# EAGLE design equaliser_TDA7418 (EAGLE 7.6.0)
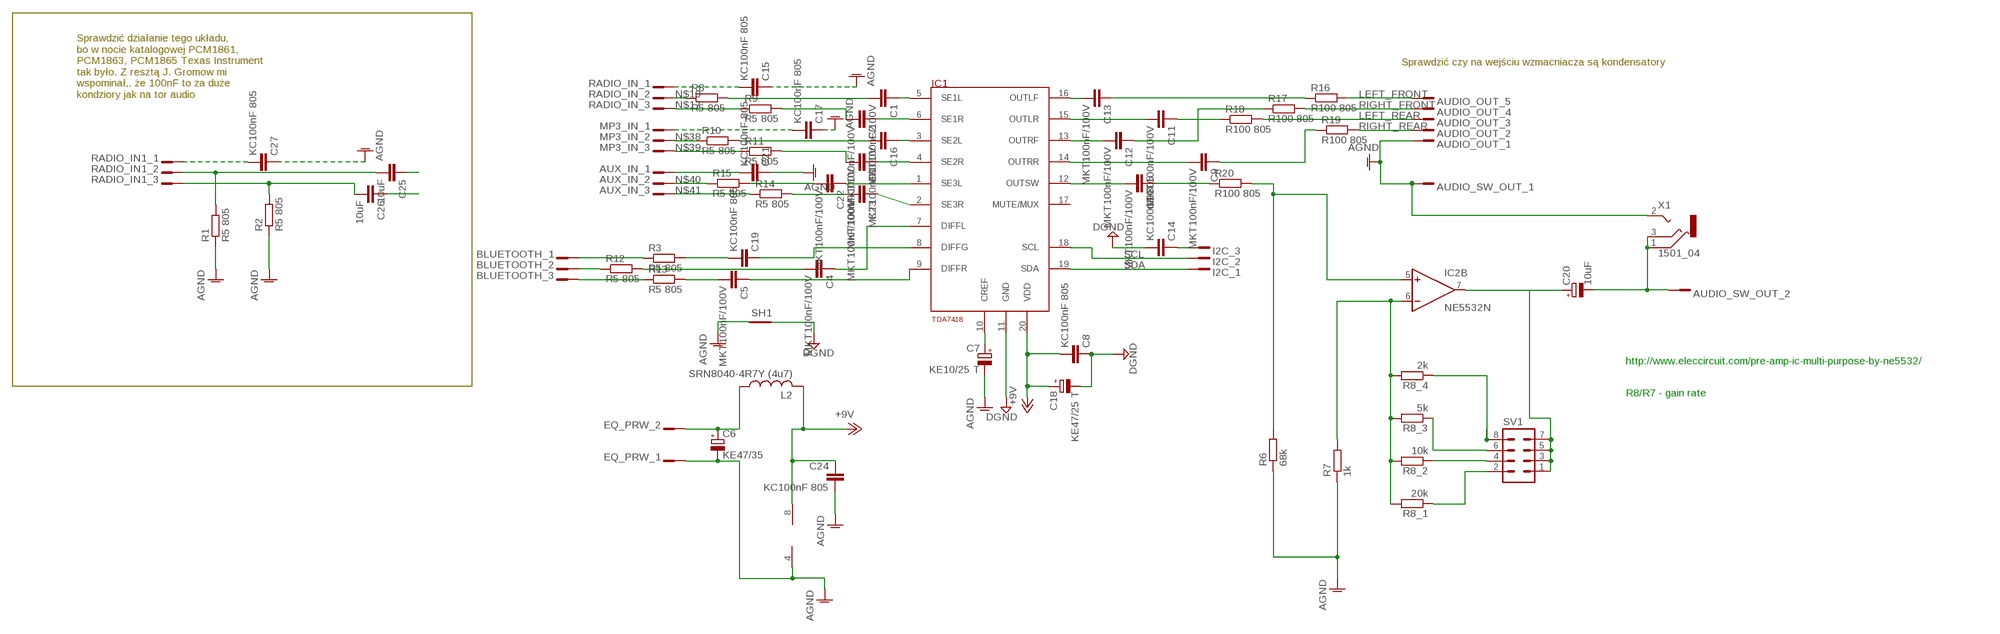
[diagram p0: schematic, sheet 1]

## Parts
AUDIO_OUT  JST_5_PIN_B5B-PH-KS  [B5B-PH-KS]
AUDIO_SW_OUT  JST_2_PIN_B2B-PH-KS  [B2B-PH-KS]
AUX_IN  JST_3_PIN_B3B-PH-KS  [B3B-PH-KS]
BLUETOOTH  JST_3_PIN_B3B-PH-KS  [B3B-PH-KS]
C1  MKT100nF/100V  C-EU050-035X075  [C050-035X075]
C2  MKT100nF/100V  C-EU050-035X075  [C050-035X075]
C3  MKT100nF/100V  C-EU050-035X075  [C050-035X075]
C4  MKT100nF/100V  C-EU050-035X075  [C050-035X075]
C5  MKT100nF/100V  C-EU050-035X075  [C050-035X075]
C6  KE47/35  CPOL-EUTT2D6  [TT2D6]
C7  KE10/25 T  CPOL-EUE1.8-4  [E1,8-4]
C8  KC100nF 805  C-EUC0805  [C0805]
C9  MKT100nF/100V  C-EU050-035X075  [C050-035X075]
C10  MKT100nF/100V  C-EU050-035X075  [C050-035X075]
C11  MKT100nF/100V  C-EU050-035X075  [C050-035X075]
C12  MKT100nF/100V  C-EU050-035X075  [C050-035X075]
C13  MKT100nF/100V  C-EU050-035X075  [C050-035X075]
C14  KC100nF 805  C-EUC0805  [C0805]
C15  KC100nF 805  C-EUC0805  [C0805]
C16  MKT100nF/100V  C-EU050-035X075  [C050-035X075]
C17  KC100nF 805  C-EUC0805  [C0805]
C18  KE47/25 T  CPOL-EUB45181B  [B45181B]
C19  KC100nF 805  C-EUC0805  [C0805]
C20  10uF  CPOL-EUTT2D6  [TT2D6]
C21  KC100nF 805  C-EUC0805  [C0805]
C22  MKT100nF/100V  C-EU050-035X075  [C050-035X075]
C23  MKT100nF/100V  C-EU050-035X075  [C050-035X075]
C24  KC100nF 805  C-EUC0805  [C0805]
C25  10uF  C-EU050-035X075  [C050-035X075]
C26  10uF  C-EU050-035X075  [C050-035X075]
C27  KC100nF 805  C-EUC0805  [C0805]
EQ_PRW  JST_2_PIN_B2B-XH-A  [B2B-XH-A]
I2C  JST_3_PIN_B3B-PH-KS  [B3B-PH-KS]
IC1  TDA7418  [SO20]
IC2  NE5532N  [DIL08]
L2  SRN8040-4R7Y (4u7)  L-US0204/5  [0204/5]
MP3_IN  JST_3_PIN_B3B-PH-KS  [B3B-PH-KS]
R1  R5 805  R-EU_R0805  [R0805]
R2  R5 805  R-EU_R0805  [R0805]
R3  R5 805  R-EU_R0805  [R0805]
R6  68k  R-EU_R0805  [R0805]
R7  1k  R-EU_R0805  [R0805]
R8  R5 805  R-EU_R0805  [R0805]
R8_1  20k  R-EU_R0805  [R0805]
R8_2  10k  R-EU_R0805  [R0805]
R8_3  5k  R-EU_R0805  [R0805]
R8_4  2k  R-EU_R0805  [R0805]
R9  R5 805  R-EU_R0805  [R0805]
R10  R5 805  R-EU_R0805  [R0805]
R11  R5 805  R-EU_R0805  [R0805]
R12  R5 805  R-EU_R0805  [R0805]
R13  R5 805  R-EU_R0805  [R0805]
R14  R5 805  R-EU_R0805  [R0805]
R15  R5 805  R-EU_R0805  [R0805]
R16  R100 805  R-EU_R0805  [R0805]
R17  R100 805  R-EU_R0805  [R0805]
R18  R100 805  R-EU_R0805  [R0805]
R19  R100 805  R-EU_R0805  [R0805]
R20  R100 805  R-EU_R0805  [R0805]
RADIO_IN  JST_3_PIN_B3B-PH-KS  [B3B-PH-KS]
RADIO_IN1  JST_3_PIN_B3B-PH-KS  [B3B-PH-KS]
SH1  SHORT-HT5  [SHORT_TOP-50]
SV1  MA04-2  [MA04-2]
X1  1501_04  [1501_05]

## Nets
+9V0: C8.2 C18.+ C24.1 IC1.20(VDD) IC2.8(P:V+) L2.2 ; supply symbol labelled +9V
AGND: AUDIO_OUT.P$1 AUDIO_SW_OUT.P$1 C6.- C7.- C15.1 C17.1 C21.1 C24.2 C27.1 EQ_PRW.P$1 IC2.4(P:V-) R1.1 R2.1 R6.1 R7.1 SH1.1 X1.2
DGND: C8.1 C14.2 C18.- IC1.11(GND) SH1.2
L1: C1.2 R8.2
L2: C16.2 R10.2
L3: C4.2 R12.2
L4: C25.2 R1.2 RADIO_IN1.P$2
LEFT_FRONT: AUDIO_OUT.P$5 R16.2
LEFT_REAR: AUDIO_OUT.P$3 R18.2
N$1: C6.+ EQ_PRW.P$2 L2.1
N$2: R8_1.1 SV1.2
N$3: C7.+ IC1.10(CREF)
N$4: C1.1 IC1.5(SE1L)
N$5: C2.1 IC1.6(SE1R)
N$6: C16.1 IC1.3(SE2L)
N$7: C3.1 IC1.4(SE2R)
N$8: C23.1 IC1.2(SE3R)
N$9: C22.1 IC1.1(SE3L)
N$10: R8.1 RADIO_IN.P$2
N$11: AUDIO_SW_OUT.P$2 C20.- X1.1 X1.3
N$12: C13.2 IC1.16(OUTLF)
N$13: C11.2 IC1.15(OUTLR)
N$14: C11.1 R18.1
N$15: C9.1 R19.1
N$16: C12.2 IC1.13(OUTRF)
N$17: R9.1 RADIO_IN.P$3
N$18: C9.2 IC1.14(OUTRR)
N$19: C10.2 IC1.12(OUTSW)
N$20: R8_2.1 SV1.4
N$21: C20.+ IC2.7(B:OUT) SV1.1 SV1.3 SV1.5 SV1.7
N$22: R8_3.1 SV1.6
N$23: C14.1 I2C.P$3
N$24: C15.2 RADIO_IN.P$1
N$25: C13.1 R16.1
N$26: C17.2 MP3_IN.P$1
N$27: BLUETOOTH.P$1 R3.1
N$28: C25.1
N$29: R8_4.1 SV1.8
N$30: C4.1 IC1.7(DIFFL)
N$31: C5.1 IC1.9(DIFFR)
N$32: C22.2 R15.2
N$33: AUX_IN.P$3 R14.1
N$34: IC2.6(B:-IN) R7.2 R8_1.2 R8_2.2 R8_3.2 R8_4.2
N$35: IC2.5(B:+IN) R6.2 R20.2
N$36: C12.1 R17.1
N$37: C10.1 R20.1
N$38: MP3_IN.P$2 R10.1
N$39: MP3_IN.P$3 R11.1
N$40: BLUETOOTH.P$2 R12.1
N$41: BLUETOOTH.P$3 R13.1
N$42: AUX_IN.P$2 R15.1
N$43: C23.2 R14.2
N$44: C2.2 R9.2
N$45: C3.2 R11.2
N$46: C5.2 R13.2
N$47: C26.1
N$48: AUX_IN.P$1 C21.2
N$49: C27.2 RADIO_IN1.P$1
N$50: C19.1 IC1.8(DIFFG)
N$51: C26.2 R2.2 RADIO_IN1.P$3
N$52: C19.2 R3.2
RIGHT_FRONT: AUDIO_OUT.P$4 R17.2
RIGHT_REAR: AUDIO_OUT.P$2 R19.2
SCL: I2C.P$2 IC1.18(SCL)
SDA: I2C.P$1 IC1.19(SDA)
Unconnected: IC1.17(MUTE/MUX) IC2.1(A:OUT) IC2.2(A:-IN) IC2.3(A:+IN)

## Notes on the sheet
- Sprawdzić czy na wejściu wzmacniacza są kondensatory
- Sprawdzić działanie tego układu,
  bo w nocie katalogowej PCM1861,
  PCM1863, PCM1865 Texas Instrument
  tak było. Z resztą J. Gromow mi
  wspominał,. że 100nF to za duże
  kondziory jak na tor audio
- http://www.eleccircuit.com/pre-amp-ic-multi-purpose-by-ne5532/
- R8/R7 - gain rate

## Library data of the parts
AUDIO_OUT = conn-JST:JST_5_PIN_
AUDIO_SW_OUT EQ_PRW = conn-JST:JST_2_PIN_
AUX_IN BLUETOOTH I2C MP3_IN RADIO_IN RADIO_IN1 = conn-JST:JST_3_PIN_
C1-C5 C8-C17 C19 C21-C27 = rcl:C-EU: CAPACITOR, European symbol
C6 C18 C20 = rcl:CPOL-EU: POLARIZED CAPACITOR, European symbol
C7 = resistor:CPOL-EU: POLARIZED CAPACITOR, European symbol
IC1 = TDA7318_DIP:TDA7418; PACKAGE: SO20
IC2 = linear:NE5532: AUDIO AMPLIFIER
L2 = rcl:L-US: INDUCTOR, American symbol
R1-R3 R6-R8 R8_1-R8_4 R9-R20 = resistor:R-EU_: RESISTOR, European symbol
SH1 = shorts-old:SHORT-H: Short between two nets; BOM: no
SV1 = con-lstb:MA04-2: PIN HEADER; OC_FARNELL: unknown; OC_NEWARK: unknown
X1 = con-lumberg:1501_0*: Jack connectors according to JISC 6560, 2.5 mm Klinkensteckverbinder nach JISC 6560, 2,5 mm Source: http://www.lumberg.com/Produkte/PDFs/1501_05.pdfedit 1501_03 http://www.lumberg.com/Produkte/PDFs/1501_06.pdf; OC_FARNELL: 1216977; OC_NEWARK: unknown

## Board
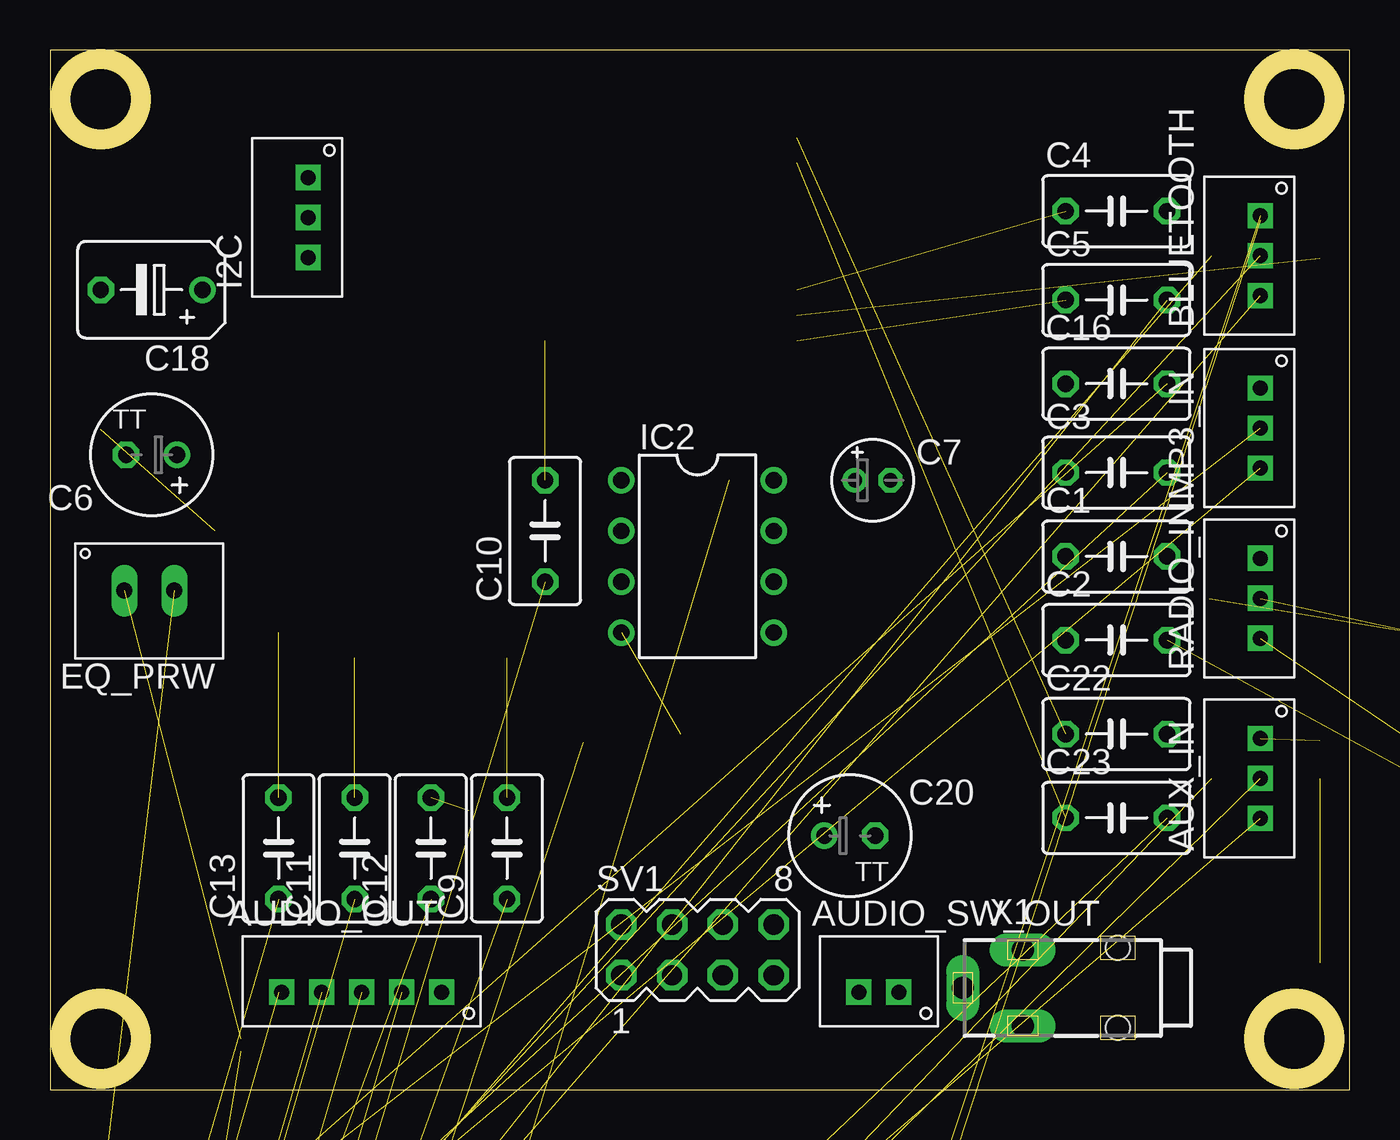
[diagram p1: board, top side]
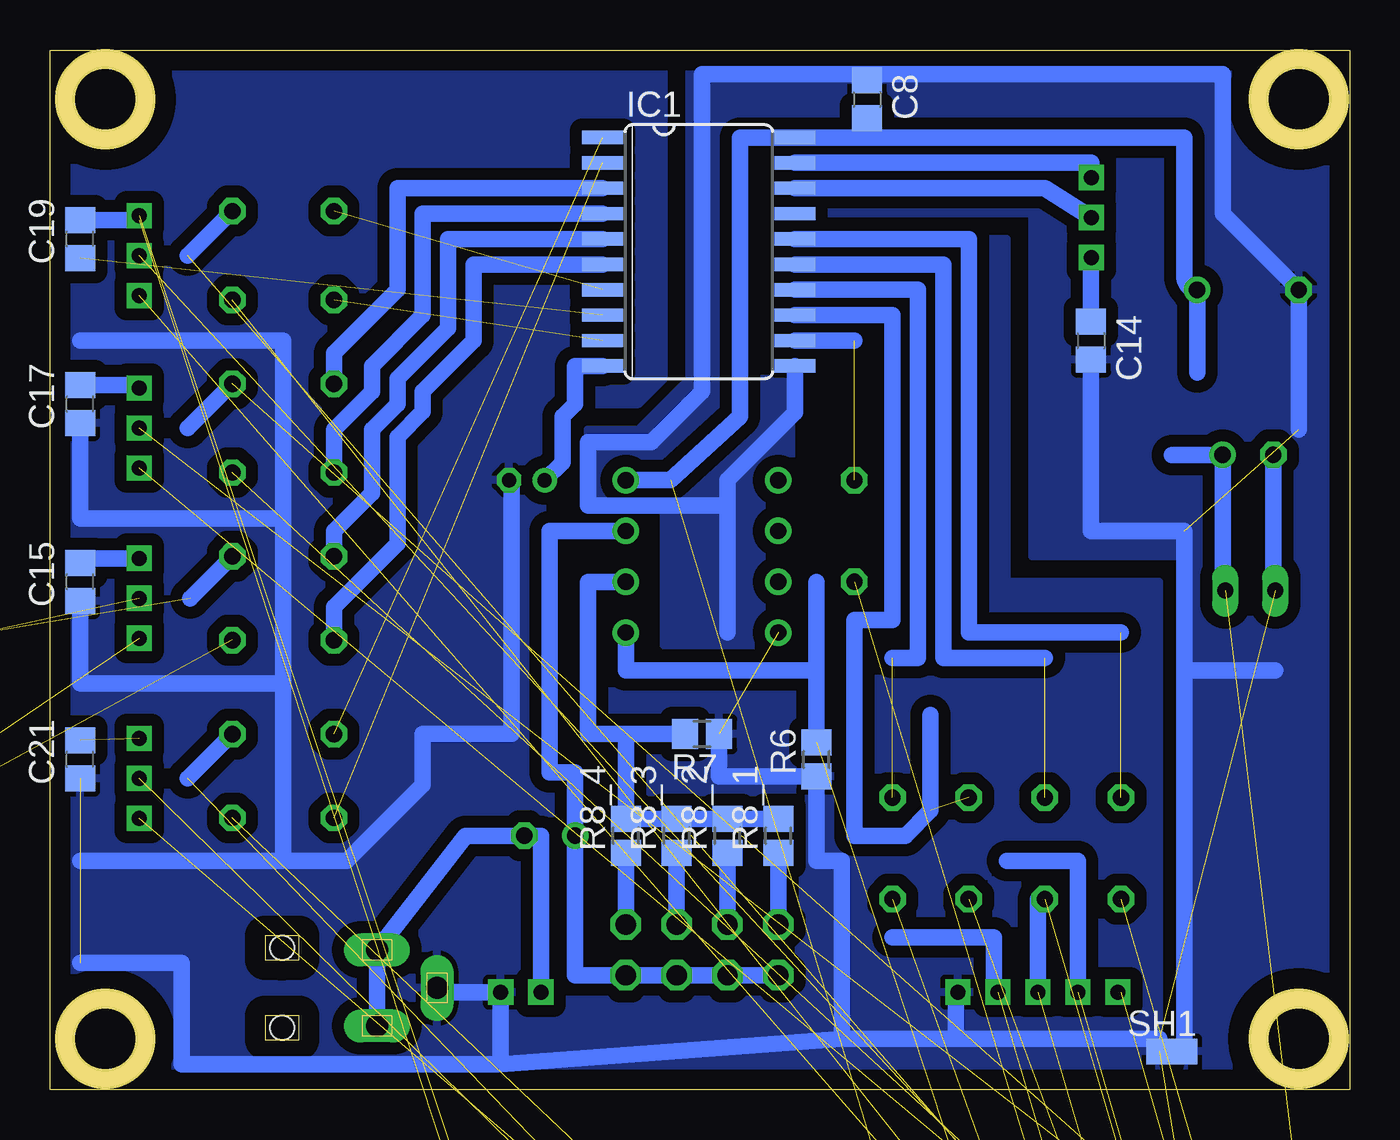
[diagram p2: board, bottom side, seen from below]

Size 65 x 52 mm. Coordinates in mm from the lower left corner, seen from the top.
Outline: 0,0 65,0 65,52 0,52 0,0
Outline: circle at 2.54,49.53 radius 2
Outline: circle at 62.23,49.53 radius 2
Outline: circle at 62.23,2.54 radius 2
Outline: circle at 2.54,2.54 radius 2
Copper layers (1*16): Top 0.035mm / dielectric 1.5mm / Bottom 0.035mm
Design rules "default": minimum track width 10mil, minimum drill 24mil, track to track 8mil, track to pad 8mil, pad to pad 8mil, via to via 8mil, smd to smd 8mil, copper to edge 40mil, drill to drill 8mil, minimum pad ring 10mil, minimum via ring 8mil, stop-mask expansion 4mil, vias tented up to drill 0mil, thermal gap 10mil

### Footprints (pad centres in the part's own frame; a part is rotated, then mirrored left to right if it is on the bottom)
B5B-PH-KS = drill 0.75 pad 1.2 square: P$1 -2,1.7; P$2 -4,1.7; P$3 -6,1.7; P$4 -8,1.7; P$5 -10,1.7
B2B-PH-KS = drill 0.75 pad 1.2 square: P$1 -2,1.7; P$2 -4,1.7
B3B-PH-KS = drill 0.75 pad 1.2 square: P$1 -2,1.7; P$2 -4,1.7; P$3 -6,1.7
C050-035X075 = drill 0.813 octagon: 1 -2.54,0; 2 2.54,0
TT2D6 = drill 0.813: + -1.27,0 | drill 0.813 octagon: - 1.27,0
E1,8-4 = drill 0.711 pad 1.168: + -0.889,0 | drill 0.711 pad 1.168 octagon: - 0.889,0
C0805 = smd 1.3 x 1.5: 1 -0.95,0; 2 0.95,0
B45181B = drill 0.813: + -2.54,0 | drill 0.813 octagon: - 2.54,0
B2B-XH-A = drill 0.8 long: P$1 -2.45,2.35; P$2 -4.95,2.35
SO20 = smd 0.66 x 2.032: 1 -4.445,-3.073; 2 -3.175,-3.073; 3 -1.905,-3.073; 4 -0.635,-3.073; 5 0.635,-3.073; 6 1.905,-3.073; 7 3.175,-3.073; 8 4.445,-3.073; 9 5.715,-3.073; 10 6.985,-3.073; 11 6.985,6.553; 12 5.715,6.553; 13 4.445,6.553; 14 3.175,6.553; 15 1.905,6.553; 16 0.635,6.553; 17 -0.635,6.553; 18 -1.905,6.553; 19 -3.175,6.553; 20 -4.445,6.553
DIL08 = drill 0.813 pad 1.27: 1 -3.81,-3.81; 2 -1.27,-3.81; 3 1.27,-3.81; 4 3.81,-3.81; 5 3.81,3.81; 6 1.27,3.81; 7 -1.27,3.81; 8 -3.81,3.81
0204/5 = drill 0.813 octagon: 1 -2.54,0; 2 2.54,0
R0805 = smd 1.3 x 1.5: 1 -0.85,0; 2 0.85,0
SHORT_TOP-50 = smd 1.27 x 1.27: 1 0.635,0; 2 -0.635,0
MA04-2 = drill 1.016 octagon: 1 -3.81,-1.27; 2 -3.81,1.27; 3 -1.27,-1.27; 4 -1.27,1.27; 5 1.27,-1.27; 6 1.27,1.27; 7 3.81,-1.27; 8 3.81,1.27
1501_05 = drill 1.1 pad 1.4 long: 1 -1.9,-8.5; 2 0,-11.5; 3 1.9,-8.5 | hole 1.2: -2,-3.75; 2,-3.75

### Placement (x,y rotation side)
AUDIO_OUT  21.59,3.17 0 top
AUDIO_SW_OUT  44.45,3.17 0 top
AUX_IN  62.23,19.56 90 top
BLUETOOTH  62.23,45.72 90 top
C1  53.34,26.67 0 top
C2  53.34,22.48 0 top
C3  53.34,30.86 0 top
C4  53.34,43.94 0 top
C5  53.34,39.5 0 top
C6  5.08,31.75 180 top
C7  41.15,30.48 0 top
C8  24.13,49.53 270 bottom
C9  22.86,12.06 90 top
C10  24.77,27.94 90 top
C11  15.24,12.06 90 top
C12  19.05,12.06 90 top
C13  11.43,12.06 90 top
C14  12.93,37.47 270 bottom
C15  63.5,25.4 90 bottom
C16  53.34,35.31 0 top
C17  63.5,34.29 90 bottom
C18  5.08,40.01 180 top
C19  63.5,42.55 90 bottom
C20  40.01,12.7 0 top
C21  63.5,16.51 90 bottom
C22  53.34,17.78 0 top
C23  53.34,13.59 0 top
C24  -7.62,-96.52 0 top  (outside the outline)
C25  -5.08,-106.68 0 top  (outside the outline)
C26  -5.08,-120.65 0 top  (outside the outline)
C27  13.97,-144.78 0 top  (outside the outline)
EQ_PRW  1.27,27.3 180 top
I2C  14.61,47.62 90 top
IC1  34.29,43.18 270 bottom
IC2  32.38,26.67 270 top
L2  -5.08,-90.17 0 top  (outside the outline)
MP3_IN  62.23,37.08 90 top
R1  1.27,-156.21 0 top  (outside the outline)
R2  8.89,-156.21 0 top  (outside the outline)
R3  -7.62,-162.56 0 top  (outside the outline)
R6  26.67,16.51 90 bottom
R7  32.38,17.78 180 bottom
R8  74.93,21.59 0 top  (outside the outline)
R8_1  28.57,12.7 90 bottom
R8_2  31.11,12.7 90 bottom
R8_3  33.66,12.7 90 bottom
R8_4  36.2,12.7 90 bottom
R9  72.39,13.97 180 top  (outside the outline)
R10  -7.62,-20.32 0 top  (outside the outline)
R11  -7.62,-26.67 0 top  (outside the outline)
R12  -7.62,-33.02 0 top  (outside the outline)
R13  -7.62,-39.37 0 top  (outside the outline)
R14  -7.62,-45.72 0 top  (outside the outline)
R15  -7.62,-52.07 0 top  (outside the outline)
R16  -7.62,-58.42 0 top  (outside the outline)
R17  -7.62,-64.77 0 top  (outside the outline)
R18  -7.62,-71.12 0 top  (outside the outline)
R19  -7.62,-77.47 0 top  (outside the outline)
R20  -7.62,-83.82 0 top  (outside the outline)
RADIO_IN  62.23,28.57 90 top
RADIO_IN1  -1.27,-148.59 0 top  (outside the outline)
SH1  8.89,1.91 180 bottom
SV1  32.38,6.99 0 top
X1  57.15,5.08 270 top

### Tracks (layer width: path | path; a pad name or v marks a point on that pad's centre or on a via)
+9V0  (2 unrouted)
  Bottom 0.813: IC2.8 33.97,30.48 30.48,33.66 30.48,47.62 IC1.20 24.13,47.62 | 24.13,47.62 8.26,47.62 8.26,40.64 arc-90 C18.+ 7.62,35.88 | C8.2 24.13,47.62
AGND  (8 unrouted)
  Bottom 0.813: AUDIO_OUT.P$1 19.68,4.88 19.68,2.54 | 19.68,2.54 25.4,2.54 | 25.4,2.54 25.4,11.43 26.67,11.43 R6.1 31.54,15.66 R7.1 | 42.45,1.27 58.42,1.27 58.42,6.35 63.5,6.35 | 42.45,1.27 25.4,2.54 | SH1.1 9.53,2.54 19.68,2.54 | 63.5,37.47 53.34,37.47 53.34,28.57 | 53.34,28.57 53.34,20.32 | 53.34,20.32 53.34,11.43 | C17.1 63.5,28.57 53.34,28.57 | C15.1 63.5,20.32 53.34,20.32 | C7.- arc90 41.91,30.35 41.91,17.78 46.35,17.78 46.35,15.24 50.16,11.43 53.34,11.43 | 42.45,1.27 AUDIO_SW_OUT.P$1 45.65,4.88 X1.2 | 63.5,11.43 53.34,11.43 | EQ_PRW.P$1 3.81,25.05 C6.-
  pour Bottom (isolate 0.61): 65.41,-1.27 9.53,-1.27 9.53,25.4 17.14,25.4 17.14,42.55 26.67,42.55 26.67,20.95 33.66,20.95 33.66,27.94 39.37,27.94 39.37,34.29 35.56,34.29 34.29,35.56 34.29,52.7 65.41,52.7
DGND  (1 unrouted)
  Bottom 0.813: 31.11,22.86 31.11,29.21 | 31.11,29.21 31.11,30.48 27.74,33.86 IC1.11 | 31.11,29.21 38.1,29.21 38.1,32.38 34.92,32.38 32.38,34.92 32.38,50.8 24.13,50.8 | 8.26,20.95 8.26,27.94 12.93,27.94 C14.2 | 8.26,20.95 3.72,20.95 | SH1.2 8.26,20.95 | 24.13,50.8 6.35,50.8 6.35,43.81 C18.- 2.54,33.02 | 24.13,50.8 C8.1
  pour Bottom (isolate 0.61): 8.26,-1.27 8.26,26.67 15.88,26.67 15.88,43.81 29.84,43.81 29.84,35.56 27.94,35.56 27.94,22.23 34.29,22.23 34.29,29.21 38.1,29.21 38.1,33.02 35.56,33.02 33.02,35.56 33.02,52.7 -0.64,52.7 -0.64,-1.27
L1  (1 unrouted)
  Bottom 0.813: 57.98,24.57 C1.2
L2  (1 unrouted)
  Bottom 0.813: 58.1,33.08 C16.2
L3  (1 unrouted)
  Bottom 0.813: 58.1,41.72 C4.2
L4  (2 unrouted)
LEFT_FRONT  (1 unrouted)
  Bottom 0.813: AUDIO_OUT.P$5 11.43,4.88
LEFT_REAR  (1 unrouted)
  Bottom 0.813: 15.59,9.53 AUDIO_OUT.P$3
N$1  (1 unrouted)
  Bottom 0.813: EQ_PRW.P$2 6.35,25.09 C6.+ 8.89,31.75
N$2
  Bottom 0.813: SV1.2 R8_1.1
N$3
  Bottom 0.813: C7.+ 39.37,31.37 39.37,33.66 38.73,34.29 38.73,36.2 IC1.10
N$4
  Bottom 0.813: IC1.5 45.09,42.55 45.09,38.1 47.62,35.56 47.62,34.29 48.9,33.02 48.9,29.84 50.8,27.94 C1.1
N$5
  Bottom 0.813: IC1.6 43.81,41.27 43.81,37.47 46.35,34.92 46.35,33.91 47.62,32.64 47.62,27.3 50.8,24.13 C2.1
N$6
  Bottom 0.813: IC1.3 47.62,45.09 47.62,40.01 50.8,36.83 C16.1
N$7
  Bottom 0.813: IC1.4 46.35,43.81 46.35,38.73 48.9,36.2 48.9,34.92 50.8,33.02 C3.1
N$8  (1 unrouted)
N$9  (1 unrouted)
N$10  (1 unrouted)
N$11
  Bottom 0.813: AUDIO_SW_OUT.P$2 40.45,12.7 C20.- 44.2,12.7 X1.1 X1.3
N$12  (1 unrouted)
  Bottom 0.813: IC1.16 19.05,42.55 19.05,22.86 11.43,22.86
N$13  (1 unrouted)
  Bottom 0.813: IC1.15 20.32,41.27 20.32,21.59 15.24,21.59
N$14  (1 unrouted)
N$15  (1 unrouted)
N$16  (1 unrouted)
  Bottom 0.813: IC1.13 22.86,38.73 22.86,23.5 24.77,23.5 24.77,12.7 22.23,12.7 20.95,13.97 20.95,18.73
N$17  (1 unrouted)
N$18  (1 unrouted)
  Bottom 0.813: IC1.14 21.59,40.01 21.59,21.59 22.86,21.59
N$19  (1 unrouted)
  Bottom 0.813: 24.77,37.47 IC1.12
N$20
  Bottom 0.813: SV1.4 R8_2.1
N$21
  Bottom 0.813: SV1.1 SV1.3 SV1.5 SV1.7 38.73,5.71 C20.+ 38.73,15.88 40.01,15.88 40.01,27.94 IC2.7
N$22
  Bottom 0.813: SV1.6 R8_3.1
N$23
  Bottom 0.813: I2C.P$3 12.93,41.62 C14.1
N$24
  Bottom 0.813: RADIO_IN.P$1 63.5,26.57 C15.2
N$25  (1 unrouted)
N$26
  Bottom 0.813: MP3_IN.P$1 60.53,35.24 C17.2
N$27  (1 unrouted)
N$29
  Bottom 0.813: SV1.8 R8_4.1
N$30  (1 unrouted)
N$31  (1 unrouted)
N$32  (1 unrouted)
  Bottom 0.813: 58.1,15.56 C22.2
N$33  (1 unrouted)
  Bottom 0.813: AUX_IN.P$3 60.53,13.59
N$34
  Bottom 0.813: R8_1.2 R8_2.2 R8_3.2 R8_4.2 36.2,17.78 R7.2 38.1,17.78 38.1,25.4 IC2.6
N$35  (1 unrouted)
  Bottom 0.813: 26.67,25.4 26.67,20.95 | 26.67,20.95 R6.2 | IC2.5 36.2,20.95 26.67,20.95
N$36  (1 unrouted)
N$37  (1 unrouted)
N$38  (1 unrouted)
N$39  (1 unrouted)
N$40  (1 unrouted)
N$41  (1 unrouted)
N$42  (1 unrouted)
N$43  (1 unrouted)
N$44  (1 unrouted)
N$45  (1 unrouted)
N$46  (1 unrouted)
N$48  (1 unrouted)
N$49  (1 unrouted)
N$50  (1 unrouted)
N$51  (2 unrouted)
N$52  (1 unrouted)
  Bottom 0.813: 60.53,43.49 C19.2
RIGHT_FRONT  (1 unrouted)
  Bottom 0.813: 17.14,11.43 13.59,11.43 AUDIO_OUT.P$4
RIGHT_REAR  (1 unrouted)
  Bottom 0.813: AUDIO_OUT.P$2 17.78,4.88 17.78,7.62 22.86,7.62
SCL
  Bottom 0.813: IC1.18 15.24,45.09 I2C.P$2
SDA
  Bottom 0.813: I2C.P$1 12.9,46.35 IC1.19

### Text on the board
Document: SDA / SCL / GND
Descript: Sprawdzić czy na wejściu wzmacniacza są kondensatory